# EAGLE schematic shield-shield (EAGLE 7.2.0)
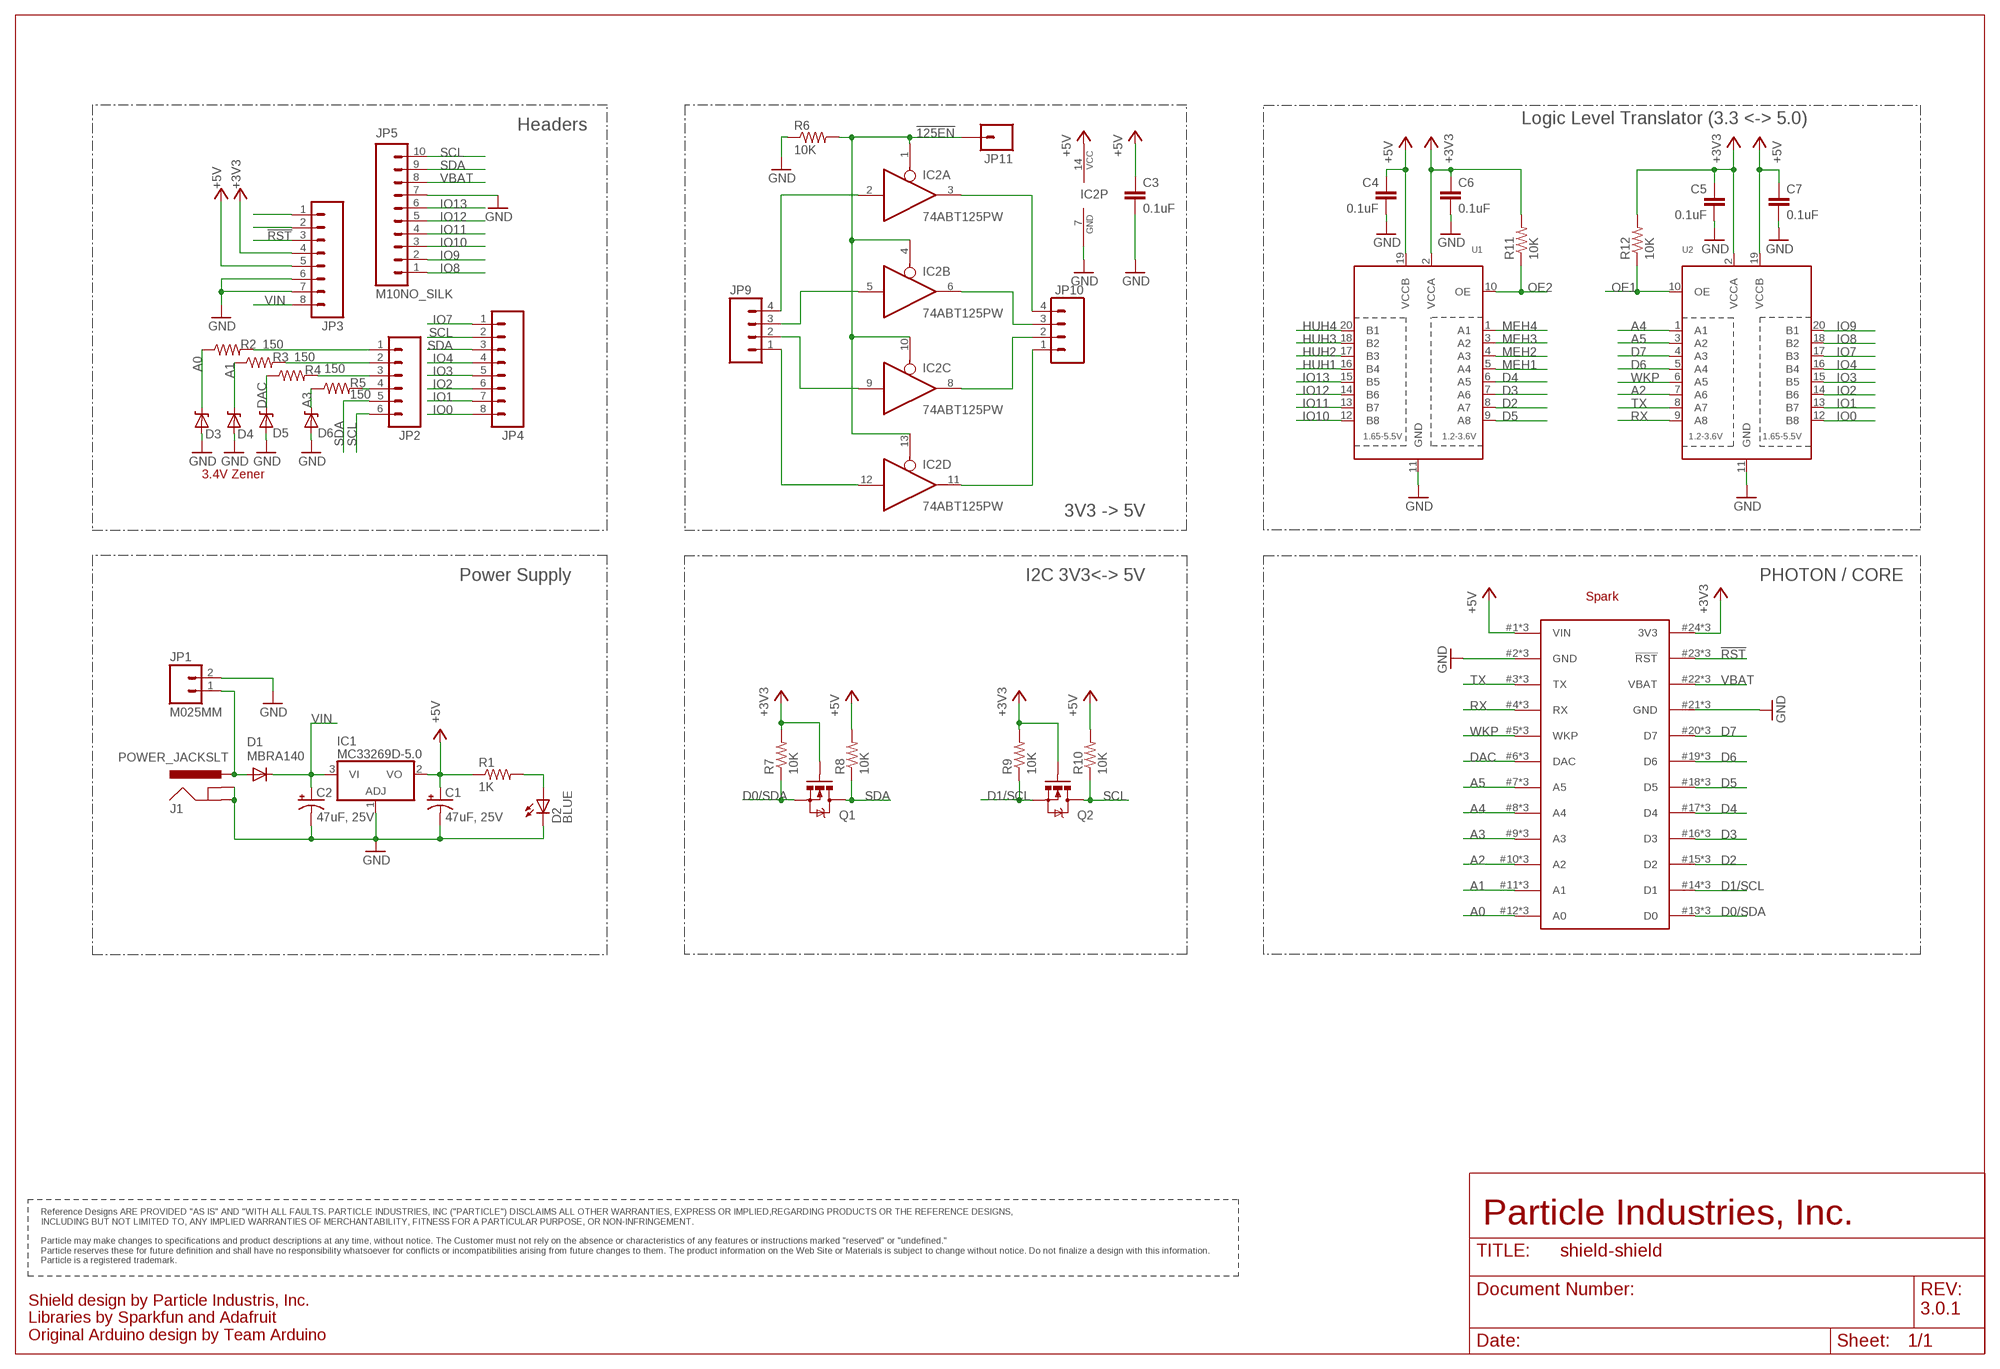
[diagram p0: schematic, sheet 1]

## Parts
C1  47uF, 25V  CAP_POLD  [PANASONIC_D]
C2  47uF, 25V  CAP_POLD  [PANASONIC_D]
C3  0.1uF  0.1UF-25V(+80/-20%)(0603)  [0603-CAP]
C4  0.1uF  0.1UF-25V(+80/-20%)(0603)  [0603-CAP]
C5  0.1uF  0.1UF-25V(+80/-20%)(0603)  [0603-CAP]
C6  0.1uF  0.1UF-25V(+80/-20%)(0603)  [0603-CAP]
C7  0.1uF  0.1UF-25V(+80/-20%)(0603)  [0603-CAP]
D1  MBRA140  DIODESMA  [SMA-DIODE]
D2  BLUE  LED-BLUE0603  [LED-0603]
D3  DIODE-ZENER-BZT52  [SOD-323]
D4  DIODE-ZENER-BZT52  [SOD-323]
D5  DIODE-ZENER-BZT52  [SOD-323]
D6  DIODE-ZENER-BZT52  [SOD-323]
IC1  MC33269D-5.0  [DPACK]
IC2  74ABT125PW  [TSSOP14]
J1  POWER_JACKSLT  [POWER_JACK_SLOT]
JP1  M025MM  [SCREWTERMINAL-5MM-2]
JP2  M06NO_SILK  [1X06_NO_SILK]
JP3  M08NO_SILK  [1X08_NO_SILK]
JP4  M08NO_SILK  [1X08_NO_SILK]
JP5  M10NO_SILK  [1X10_NO_SILK]
JP9  M041X04_NO_SILK  [1X04_NO_SILK]
JP10  M041X04_NO_SILK  [1X04_NO_SILK]
JP11  M01NOSILK-KIT  [1X01NS-KIT]
Q1  MOSFET-NCHANNELBSS138  [SOT23]
Q2  MOSFET-NCHANNELBSS138  [SOT23]
R1  1K  RESISTOR0603-RES  [0603-RES]
R2  150  RESISTOR0603-RES  [0603-RES]
R3  150  RESISTOR0603-RES  [0603-RES]
R4  150  RESISTOR0603-RES  [0603-RES]
R5  150  RESISTOR0603-RES  [0603-RES]
R6  10K  RESISTOR0603-RES  [0603-RES]
R7  10K  RESISTOR0603-RES  [0603-RES]
R8  10K  RESISTOR0603-RES  [0603-RES]
R9  10K  RESISTOR0603-RES  [0603-RES]
R10  10K  RESISTOR0603-RES  [0603-RES]
R11  10K  RESISTOR0603-RES  [0603-RES]
R12  10K  RESISTOR0603-RES  [0603-RES]
U1  TXB0108PWR  [TSSOP20]
U2  TXB0108PWR  [TSSOP20]
U$1  SPARK_CORE  SPARK_CORESTACKABLE  [SPARK_CORE_STACKABLE]
U$2  SPARK_LOGO  [SPARK_LOGO_TSTOP]

## Nets
!125EN: IC2.1(A:OE) IC2.4(B:OE) IC2.10(C:OE) IC2.13(D:OE) JP11.1 R6.2
!RST: JP3.3 U$1.23(!RST) U$1.#23(!RST) U$1.@23(!RST)
+3V3: C5.1 C6.1 JP3.4 Q1.1(G) Q2.1(G) R7.2 R9.2 R11.2 R12.2 U1.2(VCCA) U2.2(VCCA) U$1.24(3V3) U$1.#24(3V3) U$1.@24(3V3)
+5V: C1.+ C3.1 C4.1 C7.1 IC1.2(VO) IC2.14(P:VCC) JP3.5 R1.1 R8.2 R10.2 U1.19(VCCB) U2.19(VCCB) U$1.1(VIN) U$1.#1(VIN) U$1.@1(VIN)
A0: D3.1(C) R2.1 U$1.12(A0) U$1.#12(A0) U$1.@12(A0)
A1: D4.1(C) R3.1 U$1.11(A1) U$1.#11(A1) U$1.@11(A1)
A2: U2.7(A6) U$1.10(A2) U$1.#10(A2) U$1.@10(A2)
A3: D6.1(C) R5.1 U$1.9(A3) U$1.#9(A3) U$1.@9(A3)
A4: U2.1(A1) U$1.8(A4) U$1.#8(A4) U$1.@8(A4)
A5: U2.3(A2) U$1.7(A5) U$1.#7(A5) U$1.@7(A5)
D0/SDA: Q1.2(S) R7.1 U$1.13(D0) U$1.#13(D0) U$1.@13(D0)
D1/SCL: Q2.2(S) R9.1 U$1.14(D1) U$1.#14(D1) U$1.@14(D1)
D2: U1.8(A7) U$1.15(D2) U$1.#15(D2) U$1.@15(D2)
D3: U1.7(A6) U$1.16(D3) U$1.#16(D3) U$1.@16(D3)
D4: U1.6(A5) U$1.17(D4) U$1.#17(D4) U$1.@17(D4)
D5: U1.9(A8) U$1.18(D5) U$1.#18(D5) U$1.@18(D5)
D6: U2.5(A4) U$1.19(D6) U$1.#19(D6) U$1.@19(D6)
D7: U2.4(A3) U$1.20(D7) U$1.#20(D7) U$1.@20(D7)
DAC: D5.1(C) R4.1 U$1.6(DAC) U$1.#6(DAC) U$1.@6(DAC)
GND: C1.- C2.- C3.2 C4.2 C5.2 C6.2 C7.2 D2.C D3.2(A) D4.2(A) D5.2(A) D6.2(A) IC1.1(ADJ) IC2.7(P:GND) J1.GND@1(GNDBREAK) J1.GND@2(GND) JP1.2 JP3.6 JP3.7 JP5.7 R6.1 U1.11(GND) U2.11(GND) U$1.2(GND) U$1.21(GND) U$1.#2(GND) U$1.#21(GND) U$1.@2(GND) U$1.@21(GND)
HUH1: U1.16(B4)
HUH2: U1.17(B3)
HUH3: U1.18(B2)
HUH4: U1.20(B1)
IO0: JP4.8 U2.12(B8)
IO1: JP4.7 U2.13(B7)
IO2: JP4.6 U2.14(B6)
IO3: JP4.5 U2.15(B5)
IO4: JP4.4 U2.16(B4)
IO7: JP4.1 U2.17(B3)
IO8: JP5.1 U2.18(B2)
IO9: JP5.2 U2.20(B1)
IO10: JP5.3 U1.12(B8)
IO11: JP5.4 U1.13(B7)
IO12: JP5.5 U1.14(B6)
IO13: JP5.6 U1.15(B5)
MEH1: U1.5(A4)
MEH2: U1.4(A3)
MEH3: U1.3(A2)
MEH4: U1.1(A1)
N$8: D1.A J1.PWR JP1.1
N$9: D2.A R1.2
N$10: JP2.1 R2.2
N$11: JP2.2 R3.2
N$12: JP2.3 R4.2
N$34: JP2.4 R5.2
N$35: IC2.2(A:I) JP9.4
N$36: IC2.5(B:I) JP9.3
N$37: IC2.9(C:I) JP9.2
N$38: IC2.12(D:I) JP9.1
N$39: IC2.3(A:O) JP10.4
N$40: IC2.6(B:O) JP10.3
N$41: IC2.8(C:O) JP10.2
N$42: IC2.11(D:O) JP10.1
N$174: JP3.2
N$175: JP3.1
OE1: R12.1 U2.10(OE)
OE2: R11.1 U1.10(OE)
RX: U2.9(A8) U$1.4(RX) U$1.#4(RX) U$1.@4(RX)
SCL: JP2.6 JP4.2 JP5.10 Q2.3(D) R10.1
SDA: JP2.5 JP4.3 JP5.9 Q1.3(D) R8.1
TX: U2.8(A7) U$1.3(TX) U$1.#3(TX) U$1.@3(TX)
VBAT: JP5.8 U$1.22(VBAT) U$1.#22(VBAT) U$1.@22(VBAT)
VIN: C2.+ D1.C IC1.3(VI) JP3.8
WKP: U2.6(A5) U$1.5(WKP) U$1.#5(WKP) U$1.@5(WKP)

## Notes on the sheet
- Logic Level Translator (3.3 <-> 5.0)
- Headers
- 3.4V Zener
- 3V3 -> 5V
- Power Supply | I2C 3V3<-> 5V | PHOTON / CORE
- Particle Industries, Inc.
- Reference Designs ARE PROVIDED "AS IS" AND "WITH ALL FAULTS. PARTICLE INDUSTRIES, INC ("PARTICLE") DISCLAIMS ALL OTHER WARRANTIES, EXPRESS OR IMPLIED,REGARDING PRODUCTS OR THE REFERENCE DESIGNS, 
  INCLUDING BUT NOT LIMITED TO, ANY IMPLIED WARRANTIES OF MERCHANTABILITY, FITNESS FOR A PARTICULAR PURPOSE, OR NON-INFRINGEMENT.
  
  Particle may make changes to specifications and product descriptions at any time, without notice. The Customer must not rely on the absence or characteristics of any features or instructions marked "reserved" or "undefined." 
  Particle reserves these for future definition and shall have no responsibility whatsoever for conflicts or incompatibilities arising from future changes to them. The product information on the Web Site or Materials is subject to change without notice. Do not finalize a design with this information. 
  Particle is a registered trademark.
- 3.0.1
- Shield design by Particle Industris, Inc.
  Libraries by Sparkfun and Adafruit
  Original Arduino design by Team Arduino

## Library data of the parts
C1 C2 = SparkFun-Capacitors:CAP_POL: Capacitor Polarized These are standard SMD and PTH capacitors. Normally 10uF, 47uF, and 100uF in electrolytic and tantalum varieties. Always verify the external diameter of the through hole cap, it varies with capacity, voltage, and manufacturer. The EIA devices should be standard.
C3-C7 = SparkFun-Capacitors:0.1UF-25V(+80/-20%)(0603): CAP-00810 Ceramic Standard decoupling cap; PROD_ID: CAP-00810
D1 = SparkFun-DiscreteSemi:DIODE: Diode These are standard reverse protection diodes and small signal diodes. SMA package can handle up to about 1A. SOD-323 can handle about 200mA. What the SOD-323 package when ordering, there are some mfgs out there that are 5-pin packages.
D2 = SparkFun-LED:LED-BLUE: Blue LEDs for production use Various blue LEDs stocked by SparkFun production 0603 - DIO-08575 Rebel - DIO-09553 1206 - DIO-09911; PROD_ID: DIO-08575
D3-D6 = SparkFun-DiscreteSemi:DIODE-ZENER: Zener Diode Production Part - 8199 3.4V Zener Voltage
IC1 = linear:MC33269?*: Adjustable Output Low Dropout Voltage Regulator 800 mA Source: http://www.onsemi.com/pub/Collateral/MC33269-D.PDF
IC2 = 74xx-us:74*125: Quad bus BUFFER, 3-state
J1 = Spark:POWER_JACK: Power Jack This is the standard 5.5mm barrel jack for power. The PTH is the most common, proven, reliable, footprint. The Slot footprint only works if the mill layer is transmitted to the PCB fab house so be warned. Spark Fun Electronics SKU : PRT-00119 SMT: CONN-08106 Mating wall wart : TOL-00298 (and others)
JP1 = SparkFun-Connectors:M02: Standard 2-pin 0.1" header. Use with - straight break away headers ( PRT-00116) - right angle break away headers (PRT-00553) - swiss pins (PRT-00743) - machine pins (PRT-00117) - female headers (PRT-00115) Molex polarized connector foot print use with: PRT-08233 with associated crimp pins and housings. 2.54_SCREWTERM for use with PRT-10571. 3.5mm Screw Terminal footprints for PRT-08084 5mm Screw Terminal footprints for use with PRT-08433
JP2 = SparkFun-Connectors:M06: Header 6 Standard 6-pin 0.1" header. Use with straight break away headers (SKU : PRT-00116), right angle break away headers (PRT-00553), swiss pins (PRT-00743), machine pins (PRT-00117), and female headers (PRT-00115). Molex polarized connector foot print use with SKU : PRT-08094 with associated crimp pins and housings. NOTES ON THE VARIANTS LOCK and LOCK_LONGPADS... This footprint was designed to help hold the alignment of a through-hole component (i.e. 6-pin header) while soldering it into place. You may notice that each hole has been shifted either up or down by 0.005 of an inch from it's more standard position (which is a perfectly straight line). This slight alteration caused the pins (the squares in the middle) to touch the edges of the holes. Because they are alternating, it causes a "brace" to hold the component in place. 0.005 has proven to be the perfect amount of "off-center" position when using our standard breakaway headers. Although looks a little odd when you look at the bare footprint, once you have a header in there, the alteration is very hard to notice. Also,if you push a header all the way into place, it is covered up entirely on the bottom side. This idea of altering the position of holes to aid alignment will be further integrated into the Sparkfun Library for other footprints. It can help hold any component with 3 or more connection pins.
JP3 JP4 = SparkFun-Connectors:M08: Header 8 Standard 8-pin 0.1" header. Use with straight break away headers (SKU : PRT-00116), right angle break away headers (PRT-00553), swiss pins (PRT-00743), machine pins (PRT-00117), and female headers (PRT-00115).
JP5 = SparkFun-Connectors:M10: Header 10 Standard 10-pin 0.1" header. Use with straight break away headers (SKU : PRT-00116), right angle break away headers (PRT-00553), swiss pins (PRT-00743), machine pins (PRT-00117), and female headers (PRT-00115).
JP9 JP10 = SparkFun-Connectors:M04: Header 4 Standard 4-pin 0.1" header. Use with straight break away headers (SKU : PRT-00116), right angle break away headers (PRT-00553), swiss pins (PRT-00743), machine pins (PRT-00117), and female headers (PRT-00115). Molex polarized connector foot print use with SKU : PRT-08231 with associated crimp pins and housings. 1MM SMD Version SKU: PRT-10208
JP11 = SparkFun-Connectors:M01: Header 1 Standard 1-pin 0.1" header. Use with straight break away headers (SKU : PRT-00116), right angle break away headers (PRT-00553), swiss pins (PRT-00743), machine pins (PRT-00117), and female headers (PRT-00115).
Q1 Q2 = SparkFun-DiscreteSemi:MOSFET-NCHANNEL: Common NMOSFET Parts MFG P/N Store ID Prod ID FDD8780 TRANS-09984 SI7820DN TRANS-11055 FDS6630A IC-08089 2N7002PW TRANS-11151 FQP30N06L COM-10213 TRANS-10060 BSS123LT1G TRANS-08345 BSS138 TRANS-00830 BS170 2N7000; PROD_ID: TRANS-00830
R1-R12 = SparkFun-Passives:RESISTOR: Resistor Basic schematic elements and footprints for 0603, 1206, and PTH resistors.
U1 U2 = adafruit:TXB0108PWR: 8-Bit Bi-Directional Level Shifter 1.2V-3.6V (VCCA) to 1.65V-5.5V (VCCB) bi-directional level shifter with auto direction sensing. Max data rate - VCCA 1.8V: 20Mbps (50ns), VCCA 3.3V: 100Mbps (10ns) Digikey: 296-21527-1-ND
U$1 = Spark:SPARK_CORE
U$2 = Spark:SPARK_LOGO

## Net classes
0 default: width 0.152 mm, drill 0.305 mm, clearance 0.152 mm